# Altium project BC2087.PrjPcb (part 3 of 5)

## Sheet PoE_Si3404.SchDoc: =project_title
size Tabloid; CompanyName: Luxonis Holding; DrawnBy: Boris Chou / Blaz Kvas; Organization: Luxonis Holding; Address1: 1925 Harmony Park Drive; Address2: Westminster, CO; Address3: 80234; Address4: United States; DocumentNumber: D2088000; Revision: R3M1E3; SheetNumber: 3; SheetTotal: 12
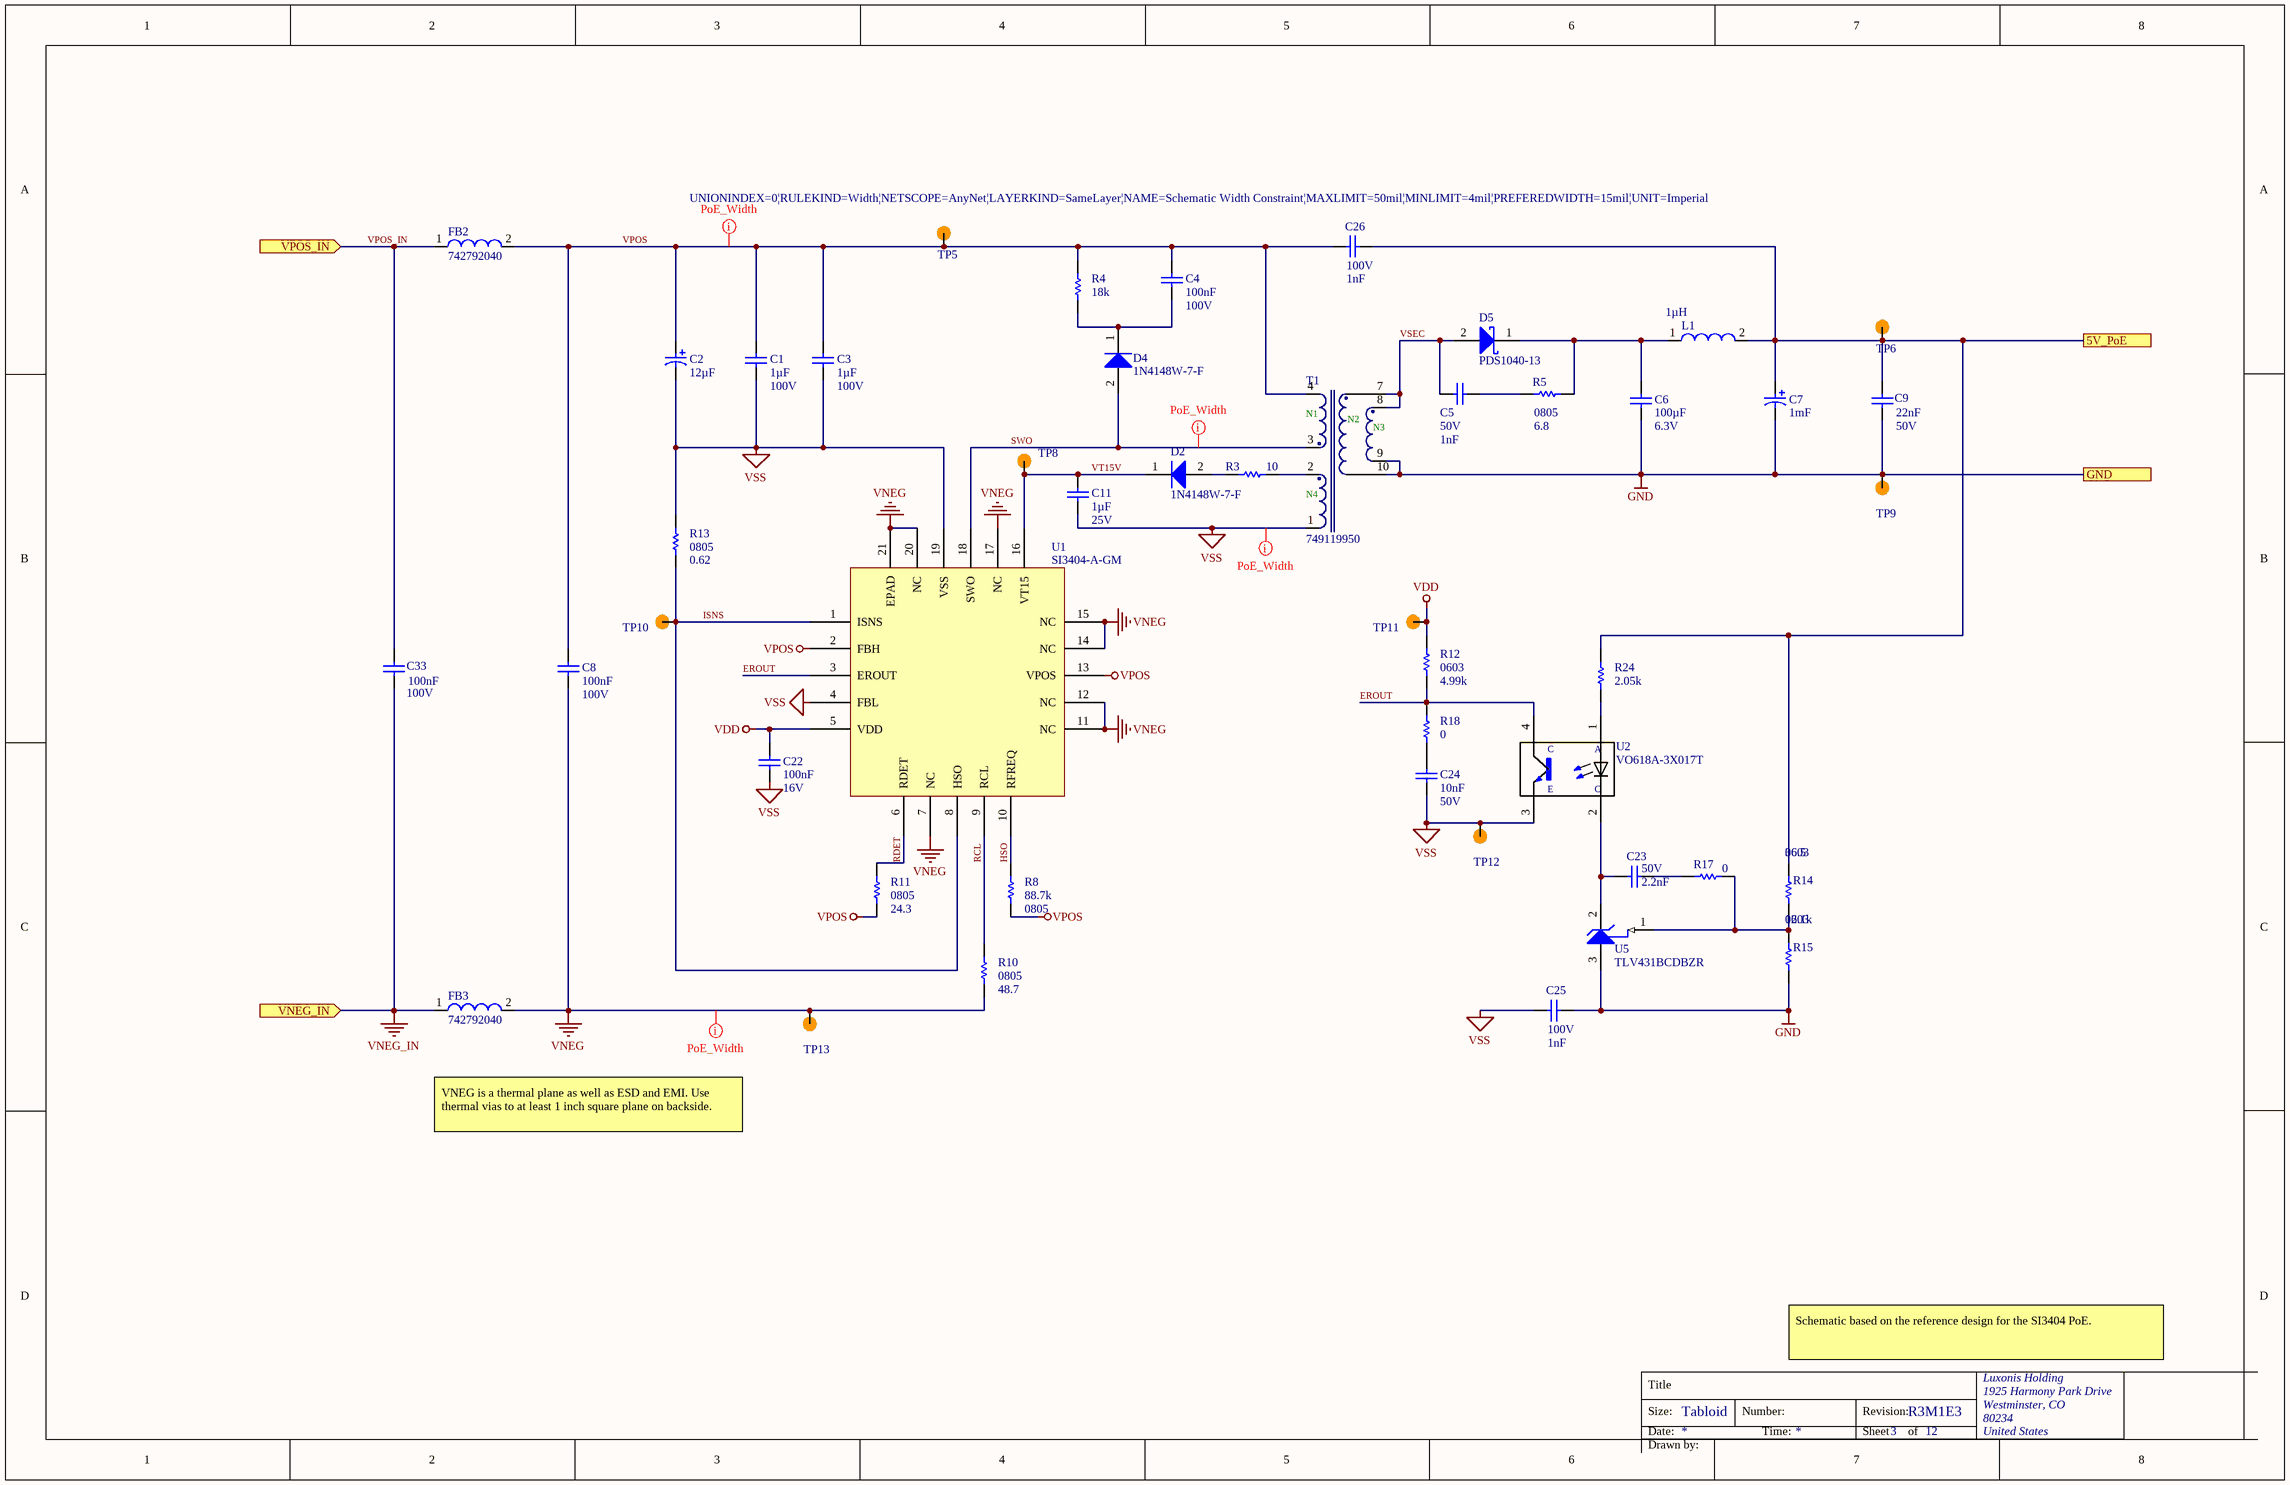
[diagram p8: PoE_Si3404.SchDoc]

### Parts
C1  value 1µF  Voltage Rating: 100V  [CAPC1210(3225)280_N]  (hidden comment: CL32B105KCJNNNE)
C2  value 12µF  [EEU-FC2A120]  (hidden comment: EEU-FC2A120)
C3  value 1µF  Voltage Rating: 100V  [CAPC1210(3225)280_N]  (hidden comment: CL32B105KCJNNNE)
C4  value 100nF  Voltage Rating: 100V  [CAPC0805(2012)145_N]  (hidden comment: CL21B104KCFNNNE)
C5  value 1nF  Voltage Rating: 50V  [CAPC0603(1608)100_N]  (hidden comment: GRM1885C1H102FA01D)
C6  value 100µF  Voltage Rating: 6.3V  [CAPC1206(3216)190_N]  (hidden comment: CL31A107MQHNNNE)
C7  value 1mF  [ECA-0JM102]  (hidden comment: ECA-0JM102)
C8  value 100nF  Voltage Rating: 100V  [CAPC0805(2012)145_N]  (hidden comment: CL21B104KCFNNNE)
C9  value 22nF  Voltage Rating: 50V  [CAPC0603(1608)100_N]  (hidden comment: C0603C223K5RACTU)
C11  value 1µF  Voltage Rating: 25V  [CAPC0402(1005)70_N]  (hidden comment: GRM155R61E105KA12D)
C22  value 100nF  Voltage Rating: 16V  [CAPC0402(1005)60_N]  (hidden comment: CL05B104KO5NFNC)
C23  value 2.2nF  Voltage Rating: 50V  [CAPC0603(1608)100_N]  (hidden comment: GRM1885C1H222JA01D)
C24  value 10nF  Voltage Rating: 50V  [CAPC0402(1005)60_N]  (hidden comment: GRM155R71H103KA88D)
C25  value 1nF  Voltage Rating: 100V  [CAPC1206(3216)130_L]  (hidden comment: C1206C102KGRACTU)
C26  value 1nF  Voltage Rating: 100V  [CAPC1206(3216)130_L]  (hidden comment: C1206C102KGRACTU)
C33  value 100nF  Voltage Rating: 100V  [CAPC0805(2012)145_N]  (hidden comment: CL21B104KCFNNNE)
D2  1N4148W-7-F  [1N4148W-7-F]
D4  1N4148W-7-F  [RS1B]
D5  PDS1040-13  [PDS1040-13]
FB2  742792040  [742792040]
FB3  742792040  [742792040]
L1  value 1µH  [DO1608C-102MLx]  (hidden comment: DO1608C-102ML)
R3  value 10  [RESC0603(1608)_N]  (hidden comment: CRCW060310R0FKEA)
R4  value 18k  [RESC0603(1608)_N]  (hidden comment: RC0603JR-0718KL)
R5  value 6.8  Case/Package: 0805  [RESC0805(2012)_N]  (hidden comment: RC0805FR-076R8L)
R8  value 88.7k  Case/Package: 0805  [RESC0805(2012)_N]  (hidden comment: CRCW080588K7FKEA)
R10  value 48.7  Case/Package: 0805  [RESC0805(2012)_N]  (hidden comment: RC0805FR-0748R7L)
R11  value 24.3  Case/Package: 0805  [RESC0805(2012)_N]  (hidden comment: CRCW080524K3FKEA)
R12  value 4.99k  Case/Package: 0603  [RESC0603(1608)_N]  (hidden comment: RC0603FR-074K99L)
R13  value 0.62  Case/Package: 0805  [RESC0805(2012)_N]  (hidden comment: RL0805FR-070R62L)
R14  value 36.5  Case/Package: 0603  [RESC0603(1608)_N]  (hidden comment: RC0603FR-0736K5L)
R15  value 12.1k  Case/Package: 0603  [RESC0603(1608)_N]  (hidden comment: RC0603FR-0712K1L)
R17  value 0  [RESC0603(1608)_N]  (hidden comment: CRCW06030000Z0EA)
R18  value 0  [RESC0603(1608)_N]  (hidden comment: CRCW06030000Z0EA)
R24  value 2.05k  [RESC0603(1608)_N]  (hidden comment: RC0603FR-072K05L)
T1  749119950  [749119950]
TP5  TEST_POINT  [TP100_200_NS]  (value not drawn)  (no BOM)
TP6  TEST_POINT  [TP100_200_NS]  (value not drawn)  (no BOM)
TP8  TEST_POINT  [TP100_200_NS]  (value not drawn)  (no BOM)
TP9  TEST_POINT  [TP100_200_NS]  (value not drawn)  (no BOM)
TP10  TEST_POINT  [TP100_200_NS]  (value not drawn)  (no BOM)
TP11  TEST_POINT  [TP100_200_NS]  (value not drawn)  (no BOM)
TP12  TEST_POINT  [TP100_200_NS]  (value not drawn)  (no BOM)
TP13  TEST_POINT  [TP100_200_NS]  (value not drawn)  (no BOM)
U1  SI3404-A-GM  [Si3404-A-GM]
U2  VO618A-3X017T  [VO618A-3X017T]
U5  TLV431BCDBZR  [TLV431BCDBZR]

### Ports
5V_PoE, GND, VNEG_IN (in), VPOS_IN (in)

### Nets
5V_PoE: C7.1 C9.2 C26.2 L1.2 R14.2 R24.2 TP6.1 ; port 5V_PoE
GND: C6.1 C7.2 C9.1 C25.2 R15.1 T1.9 T1.10 TP9.1 U5.3(ANODE) ; port GND
VDD: C22.2 R12.2 TP11.1 U1.5(VDD)
VNEG: C8.1 FB3.2 R10.1 TP13.1 U1.7(NC) U1.11(NC) U1.12(NC) U1.14(NC) U1.15(NC) U1.17(NC) U1.20(NC) U1.21(EPAD)
VNEG_IN: C33.1 FB3.1 ; port VNEG_IN
VPOS: C1.2 C2.1 C3.2 C4.2 C8.2 C26.1 FB2.2 R4.2 R8.1 R11.1 T1.4 TP5.1 U1.2(FBH) U1.13(VPOS)
VSS: C1.1 C2.2 C3.1 C11.1 C22.1 C24.1 C25.1 R13.2 T1.1 TP12.1 U1.4(FBL) U1.19(VSS) U2.3(E)
EROUT: R12.1 R18.2 U1.3(EROUT) U2.4(CO)
HSO: R8.2 U1.10(RFREQ)
ISNS: R13.1 TP10.1 U1.1(ISNS) U1.8(HSO)
RCL: R10.2 U1.9(RCL)
RDET: R11.2 U1.6(RDET)
SWO: D4.2(A) T1.3 U1.18(SWO)
VPOS_IN: C33.2 FB2.1 ; port VPOS_IN
VSEC: C5.2 D5.2(A) T1.7 T1.8
VT15V: C11.2 D2.1(K) TP8.1 U1.16(VT15)
NetC4_1: C4.1 D4.1(K) R4.1
NetC5_1: C5.1 R5.1
NetC6_2: C6.2 D5.1(K) L1.1 R5.2
NetC23_1: C23.1 U2.2(C) U5.2(CATHODE)
NetC23_2: C23.2 R17.2
NetC24_2: C24.2 R18.1
NetD2_2: D2.2(A) R3.1
NetR3_2: R3.2 T1.2
NetR14_1: R14.1 R15.2 R17.1 U5.1(REF)
NetR24_1: R24.1 U2.1(A)

### Layout directives
rule Width Constraint [Pref Width = 15mil    Min Width = 4mil    Max Width = 50mil]; net class PoE: SWO, VNEG, VPOS, VSS

### Notes on the sheet
- VNEG is a thermal plane as well as ESD and EMI. Use thermal vias to at least 1 inch square plane on backside.
- Schematic based on the reference design for the SI3404 PoE.
- Title
- Size:
- Date:
- Tabloid
- Number:
- Time:
- Revision:
- Sheet
- of
- Drawn by:
- (in symbol CMP-118-000000-2) N1; N2; N3; N4

### Library data of the parts
C1 C3 = CMP-108-000005-4: CAP CER 1UF 100V X7R 1210 10%; Manufacturer 1: Samsung; Manufacturer Part Number 1: CL32B105KCJNNNE; Case/Package: 1210; Min Operating Temperature: -55°C; Max Operating Temperature: 125°C; Tolerance: 10%; Dielectric: X7R; Length: 3.2mm; Height: 2.5mm; Width: 0.098inch; Depth: 2.5mm; ComponentLink1URL: https://datasheet.ciiva.com/26947/getdatasheetpartid-375850-26947031.pdf?src-supplier=Verical; ComponentLink1Description: https://datasheet.ciiva.com/26947/getdatasheetpartid-375850-26947031.pdf?src-supplier=Verical; ComponentLink2URL: https://datasheet.ciiva.com/16200/cl05b104kq5nnnc-16200037.pdf?src-supplier=Future+Electronics; ComponentLink2Description: https://datasheet.ciiva.com/16200/cl05b104kq5nnnc-16200037.pdf?src-supplier=Future+Electronics; Design Item ID: CL32B105KCJNNNE; Mounting Technology: SMT
C2 = CMP-108-000001-4: CAP ALUM 12UF 100V RADIAL 20%; Manufacturer 1: Panasonic; Polarity: Polar; Lead Diameter: 0.5mm; Manufacturer Part Number 1: EEU-FC2A120; Case/Package: Radial; Min Operating Temperature: -55°C; Max Operating Temperature: 105°C; Tolerance: 20%; Voltage Rating: 100V; Diameter: 6.3mm; Length: 11mm; Height: 11.2mm; Lead Pitch: 2.5mm; ComponentLink1URL: https://datasheet.ciiva.com/11781/0900766b80becf93-11781011.pdf?src-supplier=RSComponents; ComponentLink1Description: https://datasheet.ciiva.com/11781/0900766b80becf93-11781011.pdf?src-supplier=RSComponents; ComponentLink2URL: https://datasheet.ciiva.com/2984/aba0000ce22-2984054.pdf?src-supplier=Avnet; ComponentLink2Description: https://datasheet.ciiva.com/2984/aba0000ce22-2984054.pdf?src-supplier=Avnet; ComponentLink3URL: https://datasheet.ciiva.com/17535/aba0000ce22-17535638.pdf?src-supplier=Avnet+Europe; ComponentLink3Description: https://datasheet.ciiva.com/17535/aba0000ce22-17535638.pdf?src-supplier=Avnet+Europe; ComponentLink4URL: https://datasheet.ciiva.com/48518/eeufc-eng-tds-48518663.pdf?src-supplier=Distrelec; ComponentLink4Description: https://datasheet.ciiva.com/48518/eeufc-eng-tds-48518663.pdf?src-supplier=Distrelec; ComponentLink5URL: https://datasheet.ciiva.com/24023/a-e-461514-24023994.pdf?src-supplier=Mouser; ComponentLink5Description: https://datasheet.ciiva.com/24023/a-e-461514-24023994.pdf?src-supplier=Mouser; Design Item ID: EEU-FC2A120; Mounting Technology: TH
C4 C8 C33 = CMP-108-000003-5: CAP CER 0.1UF 100V X7R 0805 10%; Manufacturer 1: Samsung; Manufacturer Part Number 1: CL21B104KCFNNNE; Case/Package: 0805; Min Operating Temperature: -55°C; Max Operating Temperature: 125°C; Tolerance: 10%; Dielectric: X7R; Length: 2mm; Width: 0.049inch; Depth: 1.25mm; ComponentLink1URL: https://datasheet.ciiva.com/26936/getdatasheetpartid-781823-26936904.pdf?src-supplier=Verical; ComponentLink1Description: https://datasheet.ciiva.com/26936/getdatasheetpartid-781823-26936904.pdf?src-supplier=Verical; Design Item ID: CL21B104KCFNNNE; Mounting Technology: SMT
C5 = CMP-004-000016-6: CAP CER 1000PF 50V C0G 0603 1%; Manufacturer 1: Murata; Min Operating Temperature: -55°C; Max Operating Temperature: 125°C; Tolerance: 1%; Length: 1.6mm; Height: 0.8mm; Width: 0.031inch; Depth: 0.8mm; ComponentLink1URL: https://datasheet.ciiva.com/6072/1747444-6072454.pdf?src-supplier=Farnell; ComponentLink1Description: https://datasheet.ciiva.com/6072/1747444-6072454.pdf?src-supplier=Farnell; ComponentLink2URL: https://datasheet.ciiva.com/7828/1747444-7828892.pdf?src-supplier=Element14; ComponentLink2Description: https://datasheet.ciiva.com/7828/1747444-7828892.pdf?src-supplier=Element14; ComponentLink3URL: https://datasheet.ciiva.com/11621/c02e-11621692.pdf?src-supplier=Avnet; ComponentLink3Description: https://datasheet.ciiva.com/11621/c02e-11621692.pdf?src-supplier=Avnet; ComponentLink4URL: https://datasheet.ciiva.com/16624/c02e-16624140.pdf?src-supplier=Avnet+Europe; ComponentLink4Description: https://datasheet.ciiva.com/16624/c02e-16624140.pdf?src-supplier=Avnet+Europe; ComponentLink5URL: https://datasheet.ciiva.com/22698/1747444-22698428.pdf?src-supplier=Element14; ComponentLink5Description: https://datasheet.ciiva.com/22698/1747444-22698428.pdf?src-supplier=Element14; ComponentLink6URL: https://datasheet.ciiva.com/5416/c02e-5416637.pdf?src-supplier=Mouser; ComponentLink6Description: https://datasheet.ciiva.com/5416/c02e-5416637.pdf?src-supplier=Mouser; ComponentLink7URL: https://datasheet.ciiva.com/6270/partnumbering-e-01-6270573.pdf?src-supplier=Digi-Key; ComponentLink7Description: https://datasheet.ciiva.com/6270/partnumbering-e-01-6270573.pdf?src-supplier=Digi-Key; ComponentLink8URL: https://datasheet.ciiva.com/6270/partnumbering-e-01-6270574.pdf?src-supplier=Digi-Key; ComponentLink8Description: https://datasheet.ciiva.com/6270/partnumbering-e-01-6270574.pdf?src-supplier=Digi-Key; ComponentLink9URL: https://datasheet.ciiva.com/6270/partnumbering-e-01-6270575.pdf?src-supplier=Digi-Key; ComponentLink9Description: https://datasheet.ciiva.com/6270/partnumbering-e-01-6270575.pdf?src-supplier=Digi-Key; ComponentLink10URL: https://datasheet.ciiva.com/16426/l0005e-16426367.pdf?src-supplier=Future+Electronics; ComponentLink10Description: https://datasheet.ciiva.com/16426/l0005e-16426367.pdf?src-supplier=Future+Electronics; Manufacturer Part Number 1: GRM1885C1H102FA01D; Case/Package: 0603; Dielectric: C0G; Design Item ID: GRM1885C1H102FA01D; Mounting Technology: SMT
C6 = CMP-108-000004-5: CAP CER 100UF 6.3V X5R 1206 20%; Manufacturer 1: Samsung; Manufacturer Part Number 1: CL31A107MQHNNNE; Case/Package: 1206; Min Operating Temperature: -55°C; Max Operating Temperature: 85°C; Tolerance: 20%; Dielectric: X5R; Length: 3.2mm; Height: 1.6mm; Width: 0.063inch; Depth: 1.6mm; ComponentLink1URL: https://datasheet.ciiva.com/25723/cl31a107mqhnnne-25723159.pdf?src-supplier=Digi-Key; ComponentLink1Description: https://datasheet.ciiva.com/25723/cl31a107mqhnnne-25723159.pdf?src-supplier=Digi-Key; ComponentLink2URL: https://datasheet.ciiva.com/16437/cl31a107mqhnnne-16437212.pdf?src-supplier=Future+Electronics; ComponentLink2Description: https://datasheet.ciiva.com/16437/cl31a107mqhnnne-16437212.pdf?src-supplier=Future+Electronics; ComponentLink3URL: https://datasheet.ciiva.com/15195/getdatasheetpartid-358449-15195997.pdf?src-supplier=Verical; ComponentLink3Description: https://datasheet.ciiva.com/15195/getdatasheetpartid-358449-15195997.pdf?src-supplier=Verical; ComponentLink4URL: https://datasheet.ciiva.com/29201/452463-da-01-en-vs-kondensator-1206-29201265.pdf?src-supplier=Conrad; ComponentLink4Description: https://datasheet.ciiva.com/29201/452463-da-01-en-vs-kondensator-1206-29201265.pdf?src-supplier=Conrad; ComponentLink5URL: https://datasheet.ciiva.com/20173/71-0886-20173093.pdf?src-supplier=Rapid+Electronics; ComponentLink5Description: https://datasheet.ciiva.com/20173/71-0886-20173093.pdf?src-supplier=Rapid+Electronics; Design Item ID: CL31A107MQHNNNE; Mounting Technology: SMT
C7 = CMP-108-000000-4: CAP ALUM 1000UF 6.3V RADIAL 20%; Manufacturer 1: Panasonic; Polarity: Polar; Lead Diameter: 0.6mm; Manufacturer Part Number 1: ECA-0JM102; Case/Package: Radial; Min Operating Temperature: -40°C; Max Operating Temperature: 85°C; Tolerance: 20%; Voltage Rating: 6.3V; Diameter: 8mm; Length: 11.5mm; Height: 11.5mm; Lead Pitch: 3.5mm; ComponentLink1URL: https://datasheet.ciiva.com/11778/0900766b80f2e8a9-11778836.pdf?src-supplier=RSComponents; ComponentLink1Description: https://datasheet.ciiva.com/11778/0900766b80f2e8a9-11778836.pdf?src-supplier=RSComponents; ComponentLink2URL: https://datasheet.ciiva.com/16200/aba0000ce12-16200775.pdf?src-supplier=Future+Electronics; ComponentLink2Description: https://datasheet.ciiva.com/16200/aba0000ce12-16200775.pdf?src-supplier=Future+Electronics; ComponentLink3URL: https://datasheet.ciiva.com/17534/aba0000ce12-17534135.pdf?src-supplier=Avnet+Europe; ComponentLink3Description: https://datasheet.ciiva.com/17534/aba0000ce12-17534135.pdf?src-supplier=Avnet+Europe; ComponentLink4URL: https://datasheet.ciiva.com/24069/aba0000ce12-465472-24069879.pdf?src-supplier=Mouser; ComponentLink4Description: https://datasheet.ciiva.com/24069/aba0000ce12-465472-24069879.pdf?src-supplier=Mouser; ComponentLink5URL: https://datasheet.ciiva.com/46386/654936-46386263.pdf?src-supplier=Element14; ComponentLink5Description: https://datasheet.ciiva.com/46386/654936-46386263.pdf?src-supplier=Element14; ComponentLink6URL: https://datasheet.ciiva.com/2983/aba0000ce12-2983818.pdf?src-supplier=Avnet; ComponentLink6Description: https://datasheet.ciiva.com/2983/aba0000ce12-2983818.pdf?src-supplier=Avnet; ComponentLink7URL: https://datasheet.ciiva.com/16465/aba0000ce12-16465274.pdf?src-supplier=Avnet+Asia; ComponentLink7Description: https://datasheet.ciiva.com/16465/aba0000ce12-16465274.pdf?src-supplier=Avnet+Asia; ComponentLink8URL: https://datasheet.ciiva.com/15197/getdatasheetpartid-255691-15197835.pdf?src-supplier=Verical; ComponentLink8Description: https://datasheet.ciiva.com/15197/getdatasheetpartid-255691-15197835.pdf?src-supplier=Verical; ComponentLink9URL: https://datasheet.ciiva.com/92/aba0000ce12-92526.pdf?src-supplier=Digi-Key; ComponentLink9Description: https://datasheet.ciiva.com/92/aba0000ce12-92526.pdf?src-supplier=Digi-Key; ComponentLink10URL: https://datasheet.ciiva.com/30129/49aba0000ce12-30129310.pdf?src-supplier=Onlinecomponents.com; ComponentLink10Description: https://datasheet.ciiva.com/30129/49aba0000ce12-30129310.pdf?src-supplier=Onlinecomponents.com; Design Item ID: ECA-0JM102; Mounting Technology: TH
C9 = CMP-004-000000-5: CAP CER 0.022UF 50V X7R 0603 10%; Manufacturer 1: KEMET; Manufacturer Part Number 1: C0603C223K5RACTU; Case/Package: 0603; Min Operating Temperature: -55°C; Max Operating Temperature: 125°C; Tolerance: 10%; Dielectric: X7R; Length: 1.6mm; Height: 0.8mm; Depth: 0.8mm; Width: 0.8mm; Lead Pitch: 0.7mm; ComponentLink1URL: https://datasheet.ciiva.com/7823/1776091-7823698.pdf?src-supplier=Element14; ComponentLink1Description: https://datasheet.ciiva.com/7823/1776091-7823698.pdf?src-supplier=Element14; ComponentLink2URL: https://datasheet.ciiva.com/7824/kem-c1002-x7r-smd-7824021.pdf?src-supplier=Element14; ComponentLink2Description: https://datasheet.ciiva.com/7824/kem-c1002-x7r-smd-7824021.pdf?src-supplier=Element14; Design Item ID: C0603C223K5RACTU; Mounting Technology: SMT
C11 = CMP-108-000014-5: CAP CER 1UF 25V X5R 0402 10%; Manufacturer 1: Murata; Manufacturer Part Number 1: GRM155R61E105KA12D; Case/Package: 0402; Min Operating Temperature: -55°C; Max Operating Temperature: 85°C; Tolerance: 10%; Dielectric: X5R; Length: 1mm; Height: 0.5mm; Width: 0.5mm; Depth: 0.5mm; ComponentLink1URL: https://datasheet.ciiva.com/22732/1666664-22732122.pdf?src-supplier=Element14; ComponentLink1Description: https://datasheet.ciiva.com/22732/1666664-22732122.pdf?src-supplier=Element14; ComponentLink2URL: https://datasheet.ciiva.com/7719/1666664-7719006.pdf?src-supplier=Element14; ComponentLink2Description: https://datasheet.ciiva.com/7719/1666664-7719006.pdf?src-supplier=Element14; Design Item ID: GRM155R61E105KA12D; Mounting Technology: SMT
C22 = CMP-108-000002-6: CAP CER 0.1UF 16V X7R 0402 10%; Manufacturer 1: Samsung; Manufacturer Part Number 1: CL05B104KO5NFNC; Case/Package: 0402; Min Operating Temperature: -55°C; Max Operating Temperature: 125°C; Tolerance: 10%; Dielectric: X7R; Length: 1mm; Height: 0.5mm; Width: 0.02inch; Depth: 0.5mm; ComponentLink1URL: https://datasheet.ciiva.com/25767/cl05b104ko5nfnc-25767124.pdf?src-supplier=Digi-Key; ComponentLink1Description: https://datasheet.ciiva.com/25767/cl05b104ko5nfnc-25767124.pdf?src-supplier=Digi-Key; Design Item ID: CL05B104KO5NFNC; Mounting Technology: SMT
C23 = CMP-108-000018-5: CAP CER 2200PF 50V C0G 0603 5%; Manufacturer 1: Murata; Manufacturer Part Number 1: GRM1885C1H222JA01D; Case/Package: 0603; Min Operating Temperature: -55°C; Max Operating Temperature: 125°C; Tolerance: 5%; Dielectric: C0G; Length: 1.6mm; Height: 0.8mm; Width: 0.8mm; Depth: 0.8mm; ComponentLink1URL: https://datasheet.ciiva.com/11786/0900766b807a1cab-11786840.pdf?src-supplier=RSComponents; ComponentLink1Description: https://datasheet.ciiva.com/11786/0900766b807a1cab-11786840.pdf?src-supplier=RSComponents; ComponentLink2URL: https://datasheet.ciiva.com/3777/1632grm1885c1h222ja0123-3777835.pdf?src-supplier=Arrow; ComponentLink2Description: https://datasheet.ciiva.com/3777/1632grm1885c1h222ja0123-3777835.pdf?src-supplier=Arrow; ComponentLink3URL: https://datasheet.ciiva.com/2989/product-2989459.pdf?src-supplier=Avnet; ComponentLink3Description: https://datasheet.ciiva.com/2989/product-2989459.pdf?src-supplier=Avnet; ComponentLink4URL: https://datasheet.ciiva.com/6031/4360-6031797.pdf?src-supplier=Farnell; ComponentLink4Description: https://datasheet.ciiva.com/6031/4360-6031797.pdf?src-supplier=Farnell; ComponentLink5URL: https://datasheet.ciiva.com/7828/4360-7828918.pdf?src-supplier=Element14; ComponentLink5Description: https://datasheet.ciiva.com/7828/4360-7828918.pdf?src-supplier=Element14; ComponentLink6URL: https://datasheet.ciiva.com/11463/product-11463974.pdf?src-supplier=Avnet; ComponentLink6Description: https://datasheet.ciiva.com/11463/product-11463974.pdf?src-supplier=Avnet; ComponentLink7URL: https://datasheet.ciiva.com/16624/product-16624150.pdf?src-supplier=Avnet+Europe; ComponentLink7Description: https://datasheet.ciiva.com/16624/product-16624150.pdf?src-supplier=Avnet+Europe; ComponentLink8URL: https://datasheet.ciiva.com/7828/1747455-7828919.pdf?src-supplier=Element14; ComponentLink8Description: https://datasheet.ciiva.com/7828/1747455-7828919.pdf?src-supplier=Element14; ComponentLink9URL: https://datasheet.ciiva.com/133/partnumbering-e-01-133576.pdf?src-supplier=Digi-Key; ComponentLink9Description: https://datasheet.ciiva.com/133/partnumbering-e-01-133576.pdf?src-supplier=Digi-Key; ComponentLink10URL: https://datasheet.ciiva.com/7828/1747455-7828920.pdf?src-supplier=Element14; ComponentLink10Description: https://datasheet.ciiva.com/7828/1747455-7828920.pdf?src-supplier=Element14; ComponentLink11URL: https://datasheet.ciiva.com/133/partnumbering-e-01-133577.pdf?src-supplier=Digi-Key; ComponentLink11Description: https://datasheet.ciiva.com/133/partnumbering-e-01-133577.pdf?src-supplier=Digi-Key; ComponentLink12URL: https://datasheet.ciiva.com/133/partnumbering-e-01-133578.pdf?src-supplier=Digi-Key; ComponentLink12Description: https://datasheet.ciiva.com/133/partnumbering-e-01-133578.pdf?src-supplier=Digi-Key; ComponentLink13URL: https://datasheet.ciiva.com/29241/450664-da-01-en-vs-kondensator-0603-29241770.pdf?src-supplier=Conrad; ComponentLink13Description: https://datasheet.ciiva.com/29241/450664-da-01-en-vs-kondensator-0603-29241770.pdf?src-supplier=Conrad; Design Item ID: GRM1885C1H222JA01D; Mounting Technology: SMT
C24 = CMP-108-000016-6: CAP CER 10000PF 50V X7R 0402 10%; Manufacturer 1: Murata; Manufacturer Part Number 1: GRM155R71H103KA88D; Case/Package: 0402; Min Operating Temperature: -55°C; Max Operating Temperature: 125°C; Tolerance: 10%; Dielectric: X7R; Length: 1mm; Height: 0.5mm; Width: 0.02inch; Depth: 0.5mm; ComponentLink1URL: https://datasheet.ciiva.com/129/product-129810.pdf?src-supplier=Digi-Key; ComponentLink1Description: https://datasheet.ciiva.com/129/product-129810.pdf?src-supplier=Digi-Key; ComponentLink2URL: https://datasheet.ciiva.com/19476/1856433-19476546.pdf?src-supplier=Jameco; ComponentLink2Description: https://datasheet.ciiva.com/19476/1856433-19476546.pdf?src-supplier=Jameco; ComponentLink3URL: https://datasheet.ciiva.com/11786/0900766b80ef921d-11786340.pdf?src-supplier=RSComponents; ComponentLink3Description: https://datasheet.ciiva.com/11786/0900766b80ef921d-11786340.pdf?src-supplier=RSComponents; ComponentLink4URL: https://datasheet.ciiva.com/18100/getdatasheetpartid-27434-18100660.pdf?src-supplier=Verical; ComponentLink4Description: https://datasheet.ciiva.com/18100/getdatasheetpartid-27434-18100660.pdf?src-supplier=Verical; ComponentLink5URL: https://datasheet.ciiva.com/22698/1747449-22698420.pdf?src-supplier=Element14; ComponentLink5Description: https://datasheet.ciiva.com/22698/1747449-22698420.pdf?src-supplier=Element14; ComponentLink6URL: https://datasheet.ciiva.com/29199/454225-da-01-en-vs-kondensator-0402-29199740.pdf?src-supplier=Conrad; ComponentLink6Description: https://datasheet.ciiva.com/29199/454225-da-01-en-vs-kondensator-0402-29199740.pdf?src-supplier=Conrad; ComponentLink7URL: https://datasheet.ciiva.com/129/grm155r71h103ka88-01-129811.pdf?src-supplier=Digi-Key; ComponentLink7Description: https://datasheet.ciiva.com/129/grm155r71h103ka88-01-129811.pdf?src-supplier=Digi-Key; ComponentLink8URL: https://datasheet.ciiva.com/129/grm155r71h103ka88-01-129812.pdf?src-supplier=Digi-Key; ComponentLink8Description: https://datasheet.ciiva.com/129/grm155r71h103ka88-01-129812.pdf?src-supplier=Digi-Key; ComponentLink9URL: https://datasheet.ciiva.com/16495/product-16495290.pdf?src-supplier=Future+Electronics; ComponentLink9Description: https://datasheet.ciiva.com/16495/product-16495290.pdf?src-supplier=Future+Electronics; ComponentLink10URL: https://datasheet.ciiva.com/5410/product-5410990.pdf?src-supplier=Mouser; ComponentLink10Description: https://datasheet.ciiva.com/5410/product-5410990.pdf?src-supplier=Mouser; Design Item ID: GRM155R71H103KA88D; Mounting Technology: SMT
C25 C26 = CMP-004-000001-5: CAP CER 1nF 2000V X7R 1206 10%; Manufacturer 1: KEMET; Capacitor Type: Ceramic; Manufacturer Part Number 1: C1206C102KGRACTU; Case/Package: 1206; Min Operating Temperature: -55°C; Max Operating Temperature: 125°C; Tolerance: 10%; Dielectric: X7R; Length: 3.2mm; Height: 1.6mm; ComponentLink1URL: https://datasheet.ciiva.com:443/pdfs/VipMasterIC/IC/KEME/KEME-S-A0007617657/KEME-S-A0007567533-1.pdf?src-supplier=IHS+Markit; ComponentLink1Description: https://datasheet.ciiva.com:443/pdfs/VipMasterIC/IC/KEME/KEME-S-A0007617657/KEME-S-A0007567533-1.pdf?src-supplier=IHS+Markit; ComponentLink2URL: https://datasheet.ciiva.com/18194/getdatasheetpartid-359031-18194095.pdf?src-supplier=Verical; ComponentLink2Description: https://datasheet.ciiva.com/18194/getdatasheetpartid-359031-18194095.pdf?src-supplier=Verical; ComponentLink3URL: https://datasheet.ciiva.com/28610/1372242-28610895.pdf?src-supplier=Element14; ComponentLink3Description: https://datasheet.ciiva.com/28610/1372242-28610895.pdf?src-supplier=Element14; ComponentLink4Description: https://datasheet.ciiva.com/28672/1807957-28672854.pdf?src-supplier=Element14; ComponentLink4URL: https://datasheet.ciiva.com/28672/1807957-28672854.pdf?src-supplier=Element14; Design Item ID: C1206C102KGRACTU; Mounting Technology: SMT; Width: 1.6mm
D2 = CMP-111-000002-2: DIODE GEN PURP 100V 300MA SOD123; Manufacturer 1: Diodes; Forward Current: 150mA; Forward Voltage: 1.25V; Max Surge Current: 2A; Manufacturer Part Number 1: 1N4148W-7-F; Min Operating Temperature: -65°C; Max Operating Temperature: 150°C; Max Reverse Voltage (DC): 100V
D4 = CMP-111-000000-2: DIODE GEN PURP 100V 1A SMA; Manufacturer 1: ON Semiconductor / Fairchild; Forward Voltage: 1.3V; Max Surge Current: 30A; Manufacturer Part Number 1: RS1B; Case/Package: SMA; Min Operating Temperature: -55°C; Max Operating Temperature: 150°C; Forward Current: 1A; Max Reverse Voltage (DC): 100V
D5 = CMP-111-000001-2: DIODE SCHOTTKY 40V 10A POWERDI5; Manufacturer 1: Diodes; Forward Voltage: 510mV; Manufacturer Part Number 1: PDS1040-13; Min Operating Temperature: -65°C; Max Operating Temperature: 180°C; Forward Current: 10A; Max Reverse Voltage (DC): 40V
FB2 FB3 = CMP-112-000000-2: FERRITE BEAD 600 OHM 0805 1LN; Manufacturer 1: Wurth Electronics; Current Rating: 2A; Tolerance: 25%; Value: 5.6H; Manufacturer Part Number 1: 742792040; Case/Package: 0805
L1 = CMP-112-000002-2: IND POWER WIREWOUND 1uH 20% 100KHz FERRITE 2.7A; Manufacturer 1: Coilcraft; Manufacturer Part Number 1: DO1608C-102MLC; Self Resonant Frequency: 130MHz; Saturation Current: 2.9A; Case/Package: SMD/SMT; Tolerance: 20%
R3 = CMP-115-000012-5: RES SMD 10 OHM 1% 1/10W 0603; Manufacturer 1: Vishay; Power Rating: 100mW; Temperature Coefficient: 100ppm/°C; Voltage Rating: 75V; Manufacturer Part Number 1: CRCW060310R0FKEA; Case/Package: 0603; Min Operating Temperature: -55°C; Max Operating Temperature: 155°C; Tolerance: 1%; Design Item ID: CRCW060310R0FKEA
R4 = CMP-115-000005-6: RES SMD 18K OHM 5% 1/10W 0603; Manufacturer 1: Yageo; Power Rating: 100mW; Temperature Coefficient: 100ppm/°C; Voltage Rating: 75V; Manufacturer Part Number 1: RC0603JR-0718KL; Case/Package: 0603; Min Operating Temperature: -55°C; Max Operating Temperature: 155°C; Tolerance: 5%; Design Item ID: RC0603JR-0718KL
R5 = CMP-115-000006-7: RES SMD 6.8 OHM 1% 1/8W 0805; Manufacturer 1: Yageo; Voltage Rating: 150V; Power Rating: 125mW; Temperature Coefficient: 200ppm/°C; Manufacturer Part Number 1: RC0805FR-076R8L; Min Operating Temperature: -55°C; Max Operating Temperature: 155°C; Tolerance: 1%; Design Item ID: RC0805FR-076R8L
R8 = CMP-115-000014-7: RES SMD 88.7K OHM 1% 1/8W 0805; Manufacturer 1: Vishay; Temperature Coefficient: 100ppm/°C; Power Rating: 125mW; Voltage Rating: 150V; Manufacturer Part Number 1: CRCW080588K7FKEA; Min Operating Temperature: -55°C; Max Operating Temperature: 155°C; Tolerance: 1%; Design Item ID: CRCW080588K7FKEA
R10 = CMP-115-000021-6: RES SMD 48.7 OHM 1% 1/8W 0805; Manufacturer 1: Yageo; Temperature Coefficient: 100ppm/°C; Power Rating: 125mW; Voltage Rating: 150V; Manufacturer Part Number 1: RC0805FR-0748R7L; Min Operating Temperature: -55°C; Max Operating Temperature: 155°C; Tolerance: 1%; Design Item ID: RC0805FR-0748R7L
R11 = CMP-115-000013-7: RES SMD 24.3K OHM 1% 1/8W 0805; Manufacturer 1: Vishay; Temperature Coefficient: 100ppm/°C; Power Rating: 125mW; Voltage Rating: 150V; Manufacturer Part Number 1: CRCW080524K3FKEA; Min Operating Temperature: -55°C; Max Operating Temperature: 155°C; Tolerance: 1%; Design Item ID: CRCW080524K3FKEA
R12 = CMP-115-000020-7: RES SMD 4.99K OHM 1% 1/10W 0603; Manufacturer 1: Yageo; Temperature Coefficient: 100ppm/°C; Power Rating: 100mW; Voltage Rating: 75V; Manufacturer Part Number 1: RC0603FR-074K99L; Min Operating Temperature: -55°C; Max Operating Temperature: 155°C; Tolerance: 1%; Design Item ID: RC0603FR-074K99L
R13 = CMP-115-000022-7: RES SMD 620 MOHM 1% 1/8W 0805; Manufacturer 1: Yageo; Power Rating: 125mW; Temperature Coefficient: 200ppm/°C; Voltage Rating: 300V; Manufacturer Part Number 1: RL0805FR-070R62L; Min Operating Temperature: -55°C; Max Operating Temperature: 125°C; Tolerance: 1%; Design Item ID: RL0805FR-070R62L
R14 = CMP-115-000019-7: RES SMD 36.5K OHM 1% 1/10W 0603; Manufacturer 1: Yageo; Power Rating: 100mW; Voltage Rating: 50V; Temperature Coefficient: 100ppm/°C; Manufacturer Part Number 1: RC0603FR-0736K5L; Min Operating Temperature: -55°C; Max Operating Temperature: 155°C; Tolerance: 1%; Design Item ID: RC0603FR-0736K5L
R15 = CMP-115-000017-7: RES SMD 12.1K OHM 1% 1/10W 0603; Manufacturer 1: Yageo; Power Rating: 100mW; Temperature Coefficient: 100ppm/°C; Voltage Rating: 50V; Manufacturer Part Number 1: RC0603FR-0712K1L; Min Operating Temperature: -55°C; Max Operating Temperature: 155°C; Tolerance: 1%; Design Item ID: RC0603FR-0712K1L
R17 R18 = CMP-115-000011-7: RES SMD 0 OHM 5% 1/10W 0603; Manufacturer 1: Vishay; Manufacturer Part Number 1: CRCW0603-0000Z0EA; Power Rating: 100mW; Voltage Rating: 75V; Temperature Coefficient: 100ppm/°C; Case/Package: 0603; Min Operating Temperature: -55°C; Max Operating Temperature: 155°C; Tolerance: 5%; Design Item ID: CRCW06030000Z0EA
R24 = CMP-115-000018-4: RES SMD 2.05K OHM 1% 1/10W 0603; Manufacturer 1: Yageo; Power Rating: 100mW; Voltage Rating: 50V; Temperature Coefficient: 100ppm/°C; Manufacturer Part Number 1: RC0603FR-072K05L; Case/Package: 0603; Min Operating Temperature: -55°C; Max Operating Temperature: 155°C; Tolerance: 1%; Design Item ID: RC0603FR-072K05L
T1 = CMP-118-000000-2: TRANS FLYBACK POE 127UH SMD; Manufacturer 1: Wurth Electronics; Power Rating: 13W; Manufacturer Part Number 1: 749119950; Case/Package: SMD/SMT; Design Item ID: 749119950
TP5 TP6 TP8-TP13 = CMP-015-000000-2: Manufacturer Part Number 1: /; Design Item ID: TEST_POINT; Source: LuxonisMaster.SchLib
U1 = CMP-113-000002-3: IC POE CNTRL 1 CHANNEL 20QFN; Manufacturer 1: Silicon Labs; Manufacturer Part Number 1: SI3404-A-GM
U2 = CMP-120-000003-2: OPTOISOLATOR 5.3KV TRANS 4-SMD; Manufacturer 1: Vishay Semiconductors; Manufacturer Part Number 1: VO618A-3X017T; Case/Package: SMD/SMT
U5 = CMP-113-000006-2: IC VREF SHUNT ADJ SOT23-3; Manufacturer 1: Texas Instruments; Max Output Current: 15mA; Max Output Voltage: 6V; Max Supply Voltage: 7V; Min Supply Voltage: 1.24V; Manufacturer Part Number 1: TLV431BCDBZR; Case/Package: SOT-23; Min Operating Temperature: -40°C; Max Operating Temperature: 125°C

## Sheet POWER_GEN.SchDoc: =project_title
size Tabloid; CompanyName: Luxonis Holding; DrawnBy: Boris Chou / Blaz Kvas; Organization: Luxonis Holding; Address1: 1925 Harmony Park Drive; Address2: Westminster, CO; Address3: 80234; Address4: United States; DocumentNumber: D2088000; Revision: R3M1E3; SheetNumber: 12; SheetTotal: 12
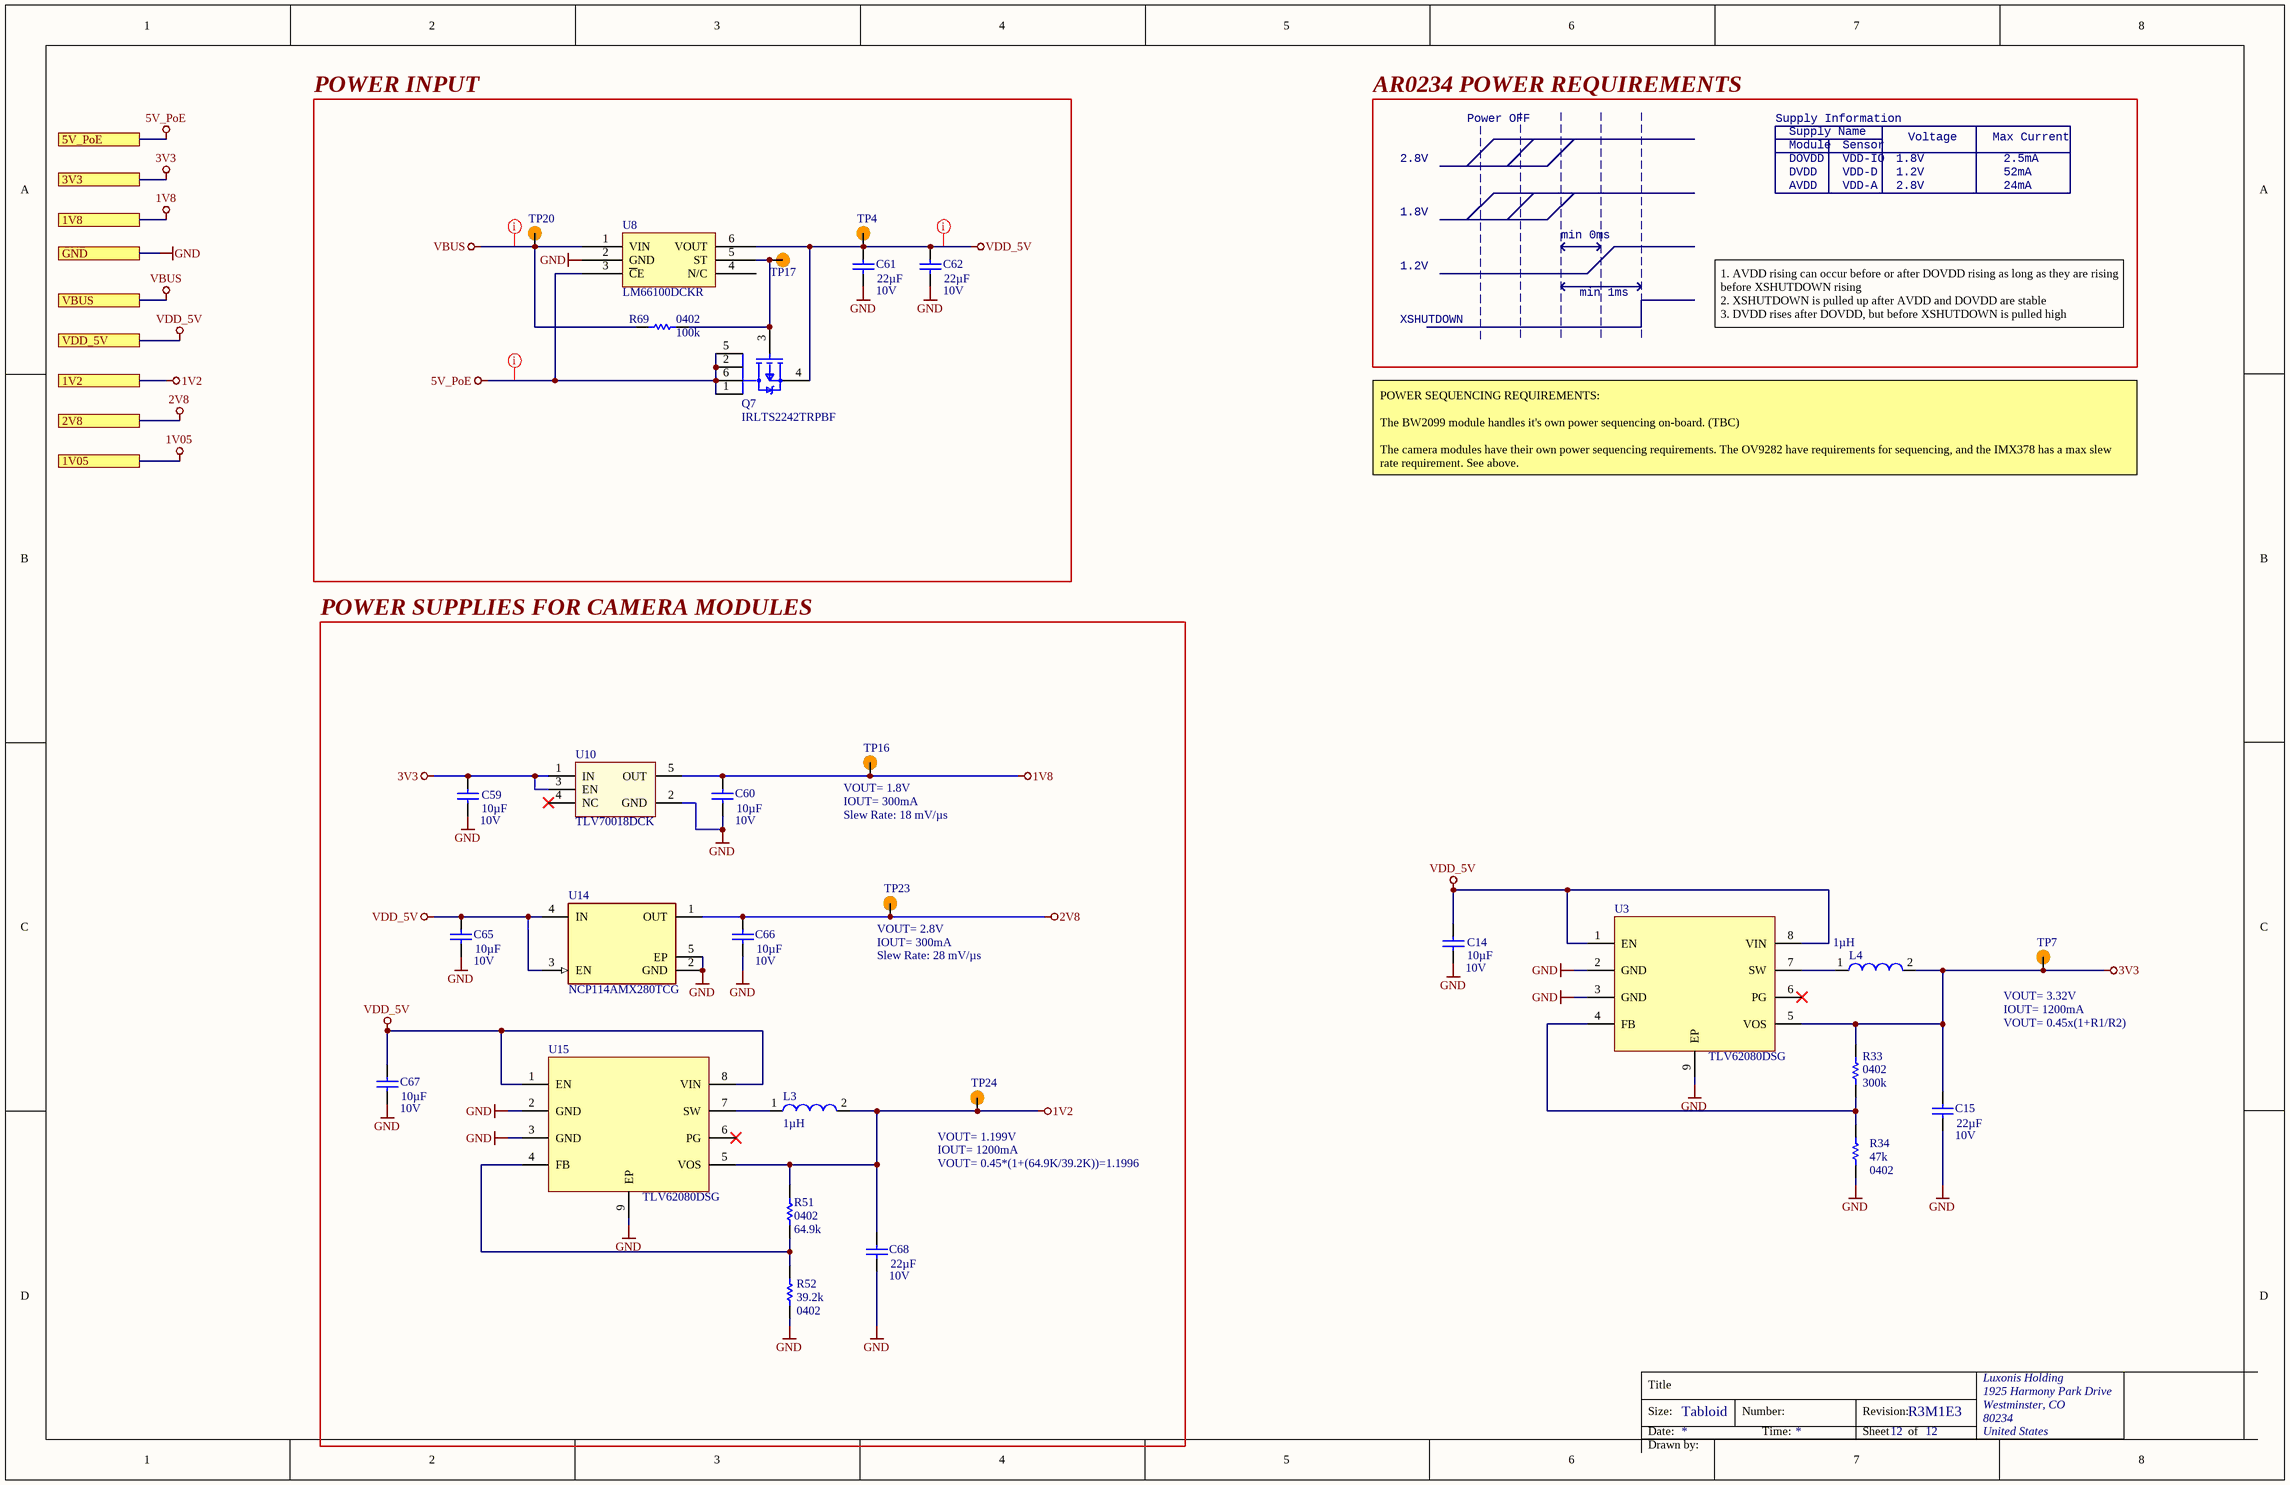
[diagram p9: POWER_GEN.SchDoc]

### Parts
C14  value 10µF  Voltage Rating: 10V  [CAPC0603(1608)100_L]  (hidden comment: GRM188R61A106ME69D)
C15  value 22µF  Voltage Rating: 10V  [CAPC0603(1608)100_L]  (hidden comment: GRM188R61A226ME15D)
C59  value 10µF  Voltage Rating: 10V  [CAPC0603(1608)100_L]  (hidden comment: GRM188R61A106ME69D)
C60  value 10µF  Voltage Rating: 10V  [CAPC0603(1608)100_L]  (hidden comment: GRM188R61A106ME69D)
C61  value 22µF  Voltage Rating: 10V  [CAPC0603(1608)100_L]  (hidden comment: GRM188R61A226ME15D)
C62  value 22µF  Voltage Rating: 10V  [CAPC0603(1608)100_L]  (hidden comment: GRM188R61A226ME15D)
C65  value 10µF  Voltage Rating: 10V  [CAPC0603(1608)100_L]  (hidden comment: GRM188R61A106ME69D)
C66  value 10µF  Voltage Rating: 10V  [CAPC0603(1608)100_L]  (hidden comment: GRM188R61A106ME69D)
C67  value 10µF  Voltage Rating: 10V  [CAPC0603(1608)100_L]  (hidden comment: GRM188R61A106ME69D)
C68  value 22µF  Voltage Rating: 10V  [CAPC0603(1608)100_L]  (hidden comment: GRM188R61A226ME15D)
L3  value 1µH  [DFE252012P-1R0M=P2]  (hidden comment: DFE252012P-1R0M=P2)
L4  value 1µH  [DFE252012P-1R0M=P2]  (hidden comment: DFE252012P-1R0M=P2)
Q7  IRLTS2242TRPBF  [TSOP-6-MFG]
R33  value 300k  Case/Package: 0402  [RESC0402(1005)_L]  (hidden comment: RC0402FR-07300KL)
R34  value 47k  Case/Package: 0402  [RESC0402(1005)_L]  (hidden comment: RC0402FR-0747KL)
R51  value 64.9k  Case/Package: 0402  [RESC0402(1005)_L]  (hidden comment: ERJ-2RKF6492X)
R52  value 39.2k  Case/Package: 0402  [RESC0402(1005)_L]  (hidden comment: CRCW040239K2FKED)
R69  value 100k  Case/Package: 0402  [RESC0402(1005)_L]  (hidden comment: RC0402FR-07100KL)
TP4  TEST_POINT  [TP100_200_NS]  (value not drawn)  (no BOM)
TP7  TEST_POINT  [TP100_200_NS]  (value not drawn)  (no BOM)
TP16  TEST_POINT  [TP100_200_NS]  (value not drawn)  (no BOM)
TP17  TEST_POINT  [TP100_200_NS]  (value not drawn)  (no BOM)
TP20  TEST_POINT  [TP100_200_NS]  (value not drawn)  (no BOM)
TP23  TEST_POINT  [TP100_200_NS]  (value not drawn)  (no BOM)
TP24  TEST_POINT  [TP100_200_NS]  (value not drawn)  (no BOM)
U3  TLV62080DSG  [TLV62080DSG]
U8  LM66100DCKR  [LM66100DCKR]
U10  TLV70018DCK  [TLV70018DCK]
U14  NCP114AMX280TCG  [FP-517CU-MFG]
U15  TLV62080DSG  [TLV62080DSG]

### Blocks framed on the sheet
POWER INPUT: C61 C62 Q7 R69 TP4 TP17 TP20 U8
POWER SUPPLIES FOR CAMERA MODULES: C59 C60 C65-C68 L3 R51 R52 TP16 TP23 TP24 U10 U14 U15

### Ports
1V2, 1V05, 1V8, 2V8, 3V3, 5V_PoE, GND, VBUS, VDD_5V

### Nets
1V2: C68.2 L3.2 R51.2 TP24.1 U15.5(VOS) ; port 1V2
1V05: port 1V05
1V8: C60.2 TP16.1 U10.5(OUT) ; port 1V8
2V8: C66.2 TP23.1 U14.1(OUT) ; port 2V8
3V3: C15.2 C59.2 L4.2 R33.2 TP7.1 U3.5(VOS) U10.1(IN) U10.3(EN) ; port 3V3
5V_PoE: Q7.1(D) Q7.2(D) Q7.5(D) Q7.6(D) U8.3(~{C}E) ; port 5V_PoE
GND: C14.1 C15.1 C59.1 C60.1 C61.2 C62.2 C65.1 C66.1 C67.1 C68.1 R34.1 R52.1 U3.2(GND) U3.3(GND) U3.9(EP) U8.2(GND) U10.2(GND) U14.2(GND) U14.5(EP) U15.2(GND) U15.3(GND) U15.9(EP) ; port GND
VBUS: R69.2 TP20.1 U8.1(VIN) ; port VBUS
VDD_5V: C14.2 C61.1 C62.1 C65.2 C67.2 Q7.4(S) TP4.1 U3.1(EN) U3.8(VIN) U8.6(VOUT) U14.3(EN) U14.4(IN) U15.1(EN) U15.8(VIN) ; port VDD_5V
NetL3_1: L3.1 U15.7(SW)
NetL4_1: L4.1 U3.7(SW)
NetQ7_3: Q7.3(G) R69.1 TP17.1 U8.5(ST)
NetR33_1: R33.1 R34.2 U3.4(FB)
NetR51_1: R51.1 R52.2 U15.4(FB)

Not connected (* = marked no-connect by the designer): U3 6(PG)*; U8 4(N/C); U10 4(NC)*; U15 6(PG)*

### Layout directives
net class Power_trace: 5V_PoE, VBUS, VDD_5V

### Notes on the sheet
- AR0234 POWER REQUIREMENTS
- 2.8V
- Power OFF
- Supply Information
- DOVDD
- Supply Name
- Module
- VDD-IO
- Sensor
- 1.8V
- Voltage
- Max Current
- 2.5mA
- AVDD
- DVDD
- VDD-A
- VDD-D
- 1.2V
- 24mA
- 52mA
- min 0ms
- min 1ms
- XSHUTDOWN
- 1. AVDD rising can occur before or after DOVDD rising as long as they are rising before XSHUTDOWN rising
  2. XSHUTDOWN is pulled up after AVDD and DOVDD are stable
  3. DVDD rises after DOVDD, but before XSHUTDOWN is pulled high
- POWER SEQUENCING REQUIREMENTS:
  The BW2099 module handles it's own power sequencing on-board. (TBC)
  The camera modules have their own power sequencing requirements. The OV9282 have requirements for sequencing, and the IMX378 has a max slew rate requirement. See above.
- (near TP16) VOUT= 1.8V
- (near TP16) IOUT= 300mA
- (near TP16) Slew Rate: 18 mV/µs
- (near TP23) VOUT= 2.8V
- (near TP23) IOUT= 300mA
- (near TP23) Slew Rate: 28 mV/µs
- (near TP7) VOUT= 3.32V
- (near TP7) IOUT= 1200mA
- VOUT= 0.45x(1+R1/R2)
- (near TP24) VOUT= 1.199V
- (near TP24) IOUT= 1200mA
- VOUT= 0.45*(1+(64.9K/39.2K))=1.1996
- Title
- Size:
- Date:
- Tabloid
- Number:
- Time:
- Revision:
- Sheet
- of
- Drawn by:

### Library data of the parts
C14 C59 C60 C65-C67 = CMP-004-000018-4: CAP CER 10UF 10V X5R 0603 20%; Manufacturer 1: Murata; Manufacturer Part Number 1: GRM188R61A106ME69D; Case/Package: 0603; Min Operating Temperature: -55°C; Max Operating Temperature: 85°C; Tolerance: 20%; Dielectric: X5R; Length: 1.6mm; Height: 0.8mm; Width: 0.8mm; Depth: 0.8mm; ComponentLink1URL: http://www.mouser.com/ds/2/281/c02e-2905.pdf?src-supplier=Mouser; ComponentLink1Description: http://www.mouser.com/ds/2/281/c02e-2905.pdf?src-supplier=Mouser; ComponentLink2URL: http://components.arrow.com/part/dataview/0323_06119472?src-supplier=Arrow+Europe; ComponentLink2Description: http://components.arrow.com/part/dataview/0323_06119472?src-supplier=Arrow+Europe; ComponentLink3URL: http://www.farnell.com/datasheets/2048014.pdf?src-supplier=Farnell; ComponentLink3Description: http://www.farnell.com/datasheets/2048014.pdf?src-supplier=Farnell; ComponentLink4URL: http://www.farnell.com/datasheets/1872210.pdf?src-supplier=Farnell; ComponentLink4Description: http://www.farnell.com/datasheets/1872210.pdf?src-supplier=Farnell; ComponentLink5URL: http://search.murata.co.jp/Ceramy/image/img/A01X/G101/ENG/GRM188R61A106ME69-01.pdf?src-supplier=Digi-Key; ComponentLink5Description: http://search.murata.co.jp/Ceramy/image/img/A01X/G101/ENG/GRM188R61A106ME69-01.pdf?src-supplier=Digi-Key; ComponentLink6URL: http://www.farnell.com/datasheets/1872210.pdf?src-supplier=Newark; ComponentLink6Description: http://www.farnell.com/datasheets/1872210.pdf?src-supplier=Newark; ComponentLink7URL: http://www.farnell.com/datasheets/2048014.pdf?src-supplier=Element14; ComponentLink7Description: http://www.farnell.com/datasheets/2048014.pdf?src-supplier=Element14; ComponentLink8URL: http://www.farnell.com/datasheets/2048014.pdf?src-supplier=Newark; ComponentLink8Description: http://www.farnell.com/datasheets/2048014.pdf?src-supplier=Newark; Design Item ID: GRM188R61A106ME69D; Mounting Technology: SMT
C15 C61 C62 C68 = CMP-108-000020-4: CAP CER 22UF 10V X5R 0603 20%; Manufacturer 1: Murata; ComponentLink1URL: https://datasheet.ciiva.com/46444/1769893-46444975.pdf?src-supplier=Element14; ComponentLink1Description: https://datasheet.ciiva.com/46444/1769893-46444975.pdf?src-supplier=Element14; Manufacturer Part Number 1: GRM188R61A226ME15D; Case/Package: 0603; Min Operating Temperature: -55°C; Max Operating Temperature: 85°C; Tolerance: 20%; Dielectric: X5R; Length: 1.6mm; Height: 0.8mm; Width: 0.8mm; Depth: 0.8mm; Design Item ID: GRM188R61A226ME15D; Mounting Technology: SMT
L3 L4 = CMP-082-000001-2: FIXED IND 1UH 3.2A 42 MOHM SMD; Manufacturer: Murata; Current Rating: 4.3A; Tolerance: 20%; Manufacturer Part Number: DFE252012P-1R0M=P2; Case/Package: 1008; Manufacturer 1: Murata; Manufacturer Part Number 1: DFE252012P-1R0M=P2; Manufacturer 2: Murata; Manufacturer Part Number 2: DFE252012P-1R0M=P2; Manufacturer 3: Murata; Manufacturer Part Number 3: DFE252012P-1R0M=P2; Manufacturer 4: Murata; Manufacturer Part Number 4: DFE252012P-1R0M=P2
Q7 = CMP-016-000020-2: MOSFET P-CH 20V 6.9A 6TSOP; Manufacturer 1: Infineon; Max Drain to Source Voltage: -20V; Case/Package: TSOP; Manufacturer Part Number 1: IRLTS2242TRPBF; Design Item ID: IRLTS2242TRPBF; Continuous Drain Current: 6.9A
R33 = CMP-013-000049-8: RES SMD 300K OHM 1% 1/16W 0402; Manufacturer 1: Yageo; Power Rating: 63mW; Voltage Rating: 50V; Manufacturer Part Number 1: RC0402FR-07300KL; Min Operating Temperature: -55°C; Max Operating Temperature: 155°C; Tolerance: 1%; Design Item ID: RC0402FR-07300KL
R34 = CMP-013-000015-9: RES SMD 47K OHM 1% 1/16W 0402; Manufacturer 1: Yageo; Power Rating: 62.5mW; Voltage Rating: 50V; Manufacturer Part Number 1: RC0402FR-0747KL; Min Operating Temperature: -55°C; Max Operating Temperature: 155°C; Tolerance: 1%; Design Item ID: RC0402FR-0747KL
R51 = CMP-009-00246-3: RES SMD 64.9K OHM 1% 0.1W 0402; Manufacturer 1: Panasonic; Power Rating: 100mW; Voltage Rating: 50V; Manufacturer Part Number 1: ERJ-2RKF6492X; Tolerance: 1%
R52 = CMP-013-000027-8: RES SMD 39.2K OHM 1% 1/16W 0402; Manufacturer 1: Vishay; Power Rating: 63mW; Voltage Rating: 50V; Manufacturer Part Number 1: CRCW040239K2FKED; Min Operating Temperature: -55°C; Max Operating Temperature: 155°C; Tolerance: 1%; Design Item ID: CRCW040239K2FKED
R69 = CMP-013-000035-8: RES SMD 100K OHM 1% 1/16W 0402; Manufacturer 1: Yageo; Power Rating: 63mW; Voltage Rating: 50V; Manufacturer Part Number 1: RC0402FR-07100KL; Min Operating Temperature: -55°C; Max Operating Temperature: 155°C; Tolerance: 1%; Design Item ID: RC0402FR-07100KL
TP4 TP7 TP16 TP17 TP20 TP23 TP24 = CMP-015-000000-2: Manufacturer Part Number 1: /; Design Item ID: TEST_POINT; Source: LuxonisMaster.SchLib
U3 U15 = CMP-010-000007-3: IC REG BUCK ADJ 1.2A SYNC 8WSON; Manufacturer 1: Texas Instruments; Manufacturer Part Number 1: TLV62080DSGR; Output Voltage: 4V; Min Supply Voltage: 2.5V; Min Output Voltage: 500mV; Max Supply Voltage: 5.5V; Vfb/Vout: 0V; Min Operating Temperature: -40°C; Max Operating Temperature: 125°C; Max Output Current: 1.2A; Max Output Voltage: 4V
U8 = CMP-099-000001-2: IC OR CTRLR IDEAL DIODE SC70-6; Manufacturer 1: Texas Instruments; Manufacturer Part Number 1: LM66100DCKR
U10 = CMP-113-000003-2: IC REG LINEAR 1.8V 200MA SC70-5 Linear Voltage Regulator IC  1 Output  200mA SC-70-5; Manufacturer 1: Texas Instruments; Manufacturer Part Number 1: TLV70018DCKR; Max Supply Voltage: 5.5V; Min Supply Voltage: 2V; Case/Package: SC; Min Operating Temperature: -40°C; Max Operating Temperature: 125°C; Max Output Current: 200mA; Max Output Voltage: 1.8V; Min Output Voltage: 1.8V; Pins: 5
U14 = CMP-019-00053-3: Fixed Positive LDO Regulator, 2.8V, 0.23V Dropout, CMOS, PDSO4; Manufacturer 1: OnSemi; Max Supply Voltage: 5.5V; Min Supply Voltage: 1.7V; Max Output Current: 300mA; Vfb/Vout: 0V; Pins: 5; Output Voltage: 2.8V; Manufacturer Part Number 1: NCP114AMX280TCG; Case/Package: UDFN-4